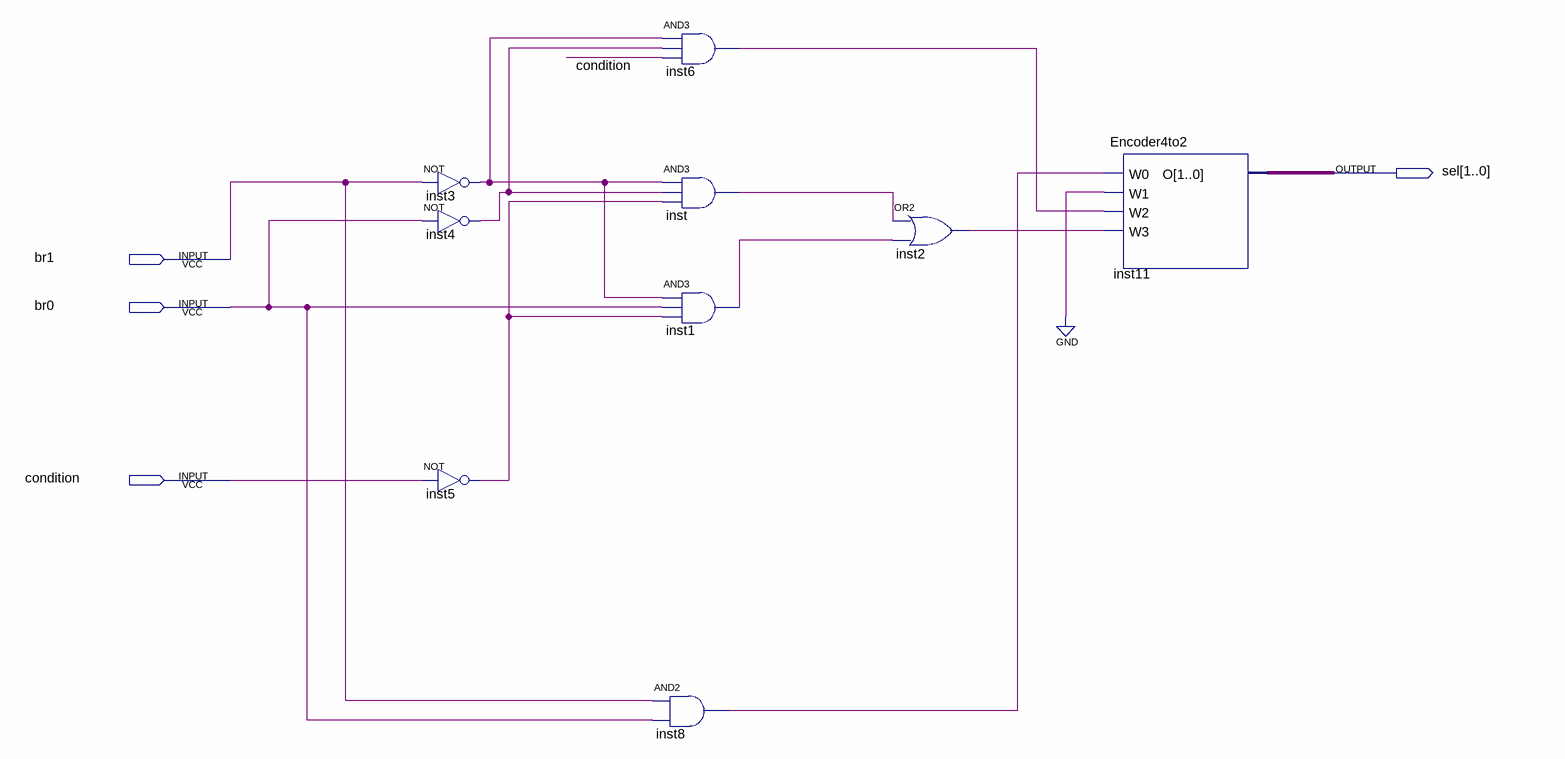
[diagram p0: schematic sheet]
// Quartus schematic inputlogic.bdf as structural Verilog: 9 symbols, 4 pins
module inputlogic (
  input  br1,
  input  br0,
  input  condition,
  output [1:0] sel
);

  wire inst1_out, inst2_out, inst3_out, inst4_out, inst5_out, inst6_out, inst8_out, inst_out;

  not inst3 (inst3_out, br1);
  not inst4 (inst4_out, br0);
  not inst5 (inst5_out, condition);
  and inst6 (inst6_out, inst3_out, inst4_out, condition);
  and inst (inst_out, inst3_out, inst4_out, inst5_out);
  and inst1 (inst1_out, inst3_out, br0, inst5_out);
  and inst8 (inst8_out, br1, br0);
  or inst2 (inst2_out, inst_out, inst1_out);
  Encoder4to2 inst11 (.W0(inst8_out), .W1(1'b0), .W2(inst6_out), .W3(inst2_out), .O(sel));
endmodule
